# Altium schematic sheet Phase_Measurements.SchDoc
size A4; CompanyName: Technische Hochschule Nürnberg Georg Simon Ohm; Organization: UltraZohm; Address1: Kesslerplatz 12; Address2: 90489 Nürnberg; Address3: GERMANY; SheetNumber: 4; SheetTotal: 9; Website: www.ultrazohm.com
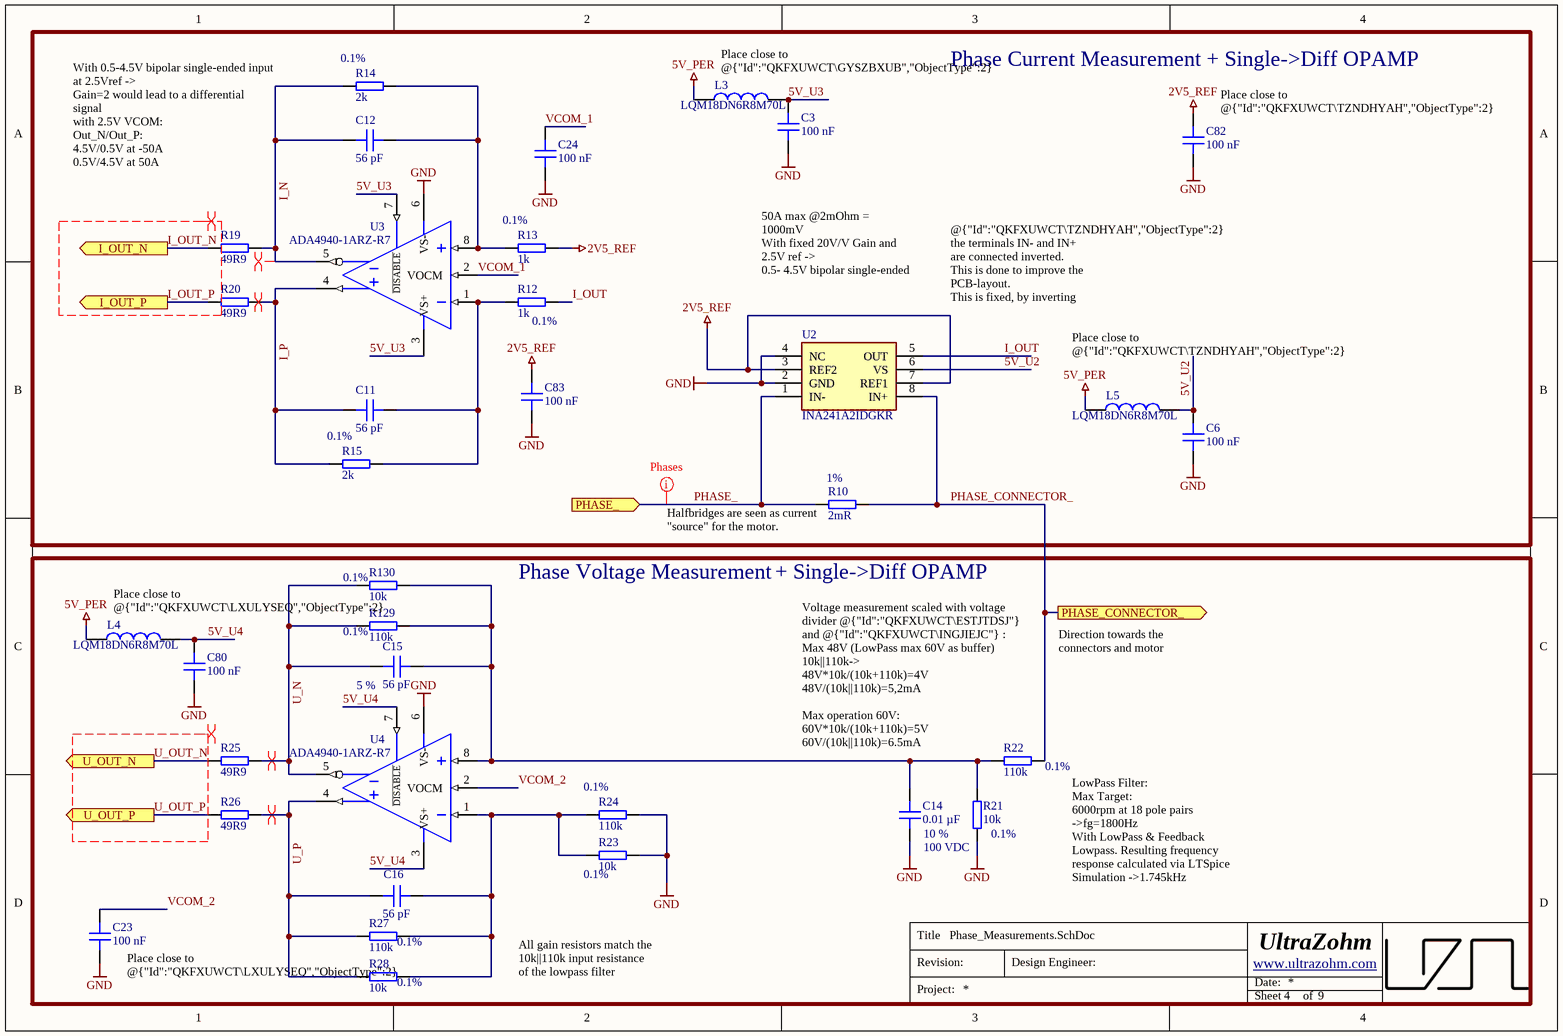
[diagram p0: Phase_Measurements.SchDoc]

## Parts
C3  100 nF  [C_0603]
C6  100 nF  [C_0603]
C11  56 pF  [C_0603]
C12  56 pF  [C_0603]
C14  0.01 µF  Tolerance: 10 %  Voltage Rating: 100 VDC  [C_0805]
C15  56 pF  Tolerance: 5 %  [C_0603]
C16  56 pF  [C_0603]
C23  100 nF  [C_0603]
C24  100 nF  [C_0603]
C80  100 nF  [C_0603]
C82  100 nF  [C_0603]
C83  100 nF  [C_0603]
L3  LQM18DN6R8M70L  [INDC1608X95N]
L4  LQM18DN6R8M70L  [INDC1608X95N]
L5  LQM18DN6R8M70L  [INDC1608X95N]
R10  2mR  Tolerance: 1%  [3921]
R12  1k  Tolerance: 0.1%  [RES 0603_1608]
R13  1k  Tolerance: 0.1%  [RES 0603_1608]
R14  2k  Tolerance: 0.1%  [RES 0603_1608]
R15  2k  Tolerance: 0.1%  [RES 0603_1608]
R19  49R9  [RES 0603_1608]
R20  49R9  [RES 0603_1608]
R21  10k  Tolerance: 0.1%  [RES 0603_1608]
R22  110k  Tolerance: 0.1%  [RES 0603_1608]
R23  10k  Tolerance: 0.1%  [RES 0603_1608]
R24  110k  Tolerance: 0.1%  [RES 0603_1608]
R25  49R9  [RES 0603_1608]
R26  49R9  [RES 0603_1608]
R27  110k  Tolerance: 0.1%  [RES 0603_1608]
R28  10k  Tolerance: 0.1%  [RES 0603_1608]
R129  110k  Tolerance: 0.1%  [RES 0603_1608]
R130  10k  Tolerance: 0.1%  [RES 0603_1608]
U2  INA241A2IDGKR  [SOP65P490X110-8N]
U3  ADA4940-1ARZ-R7  [SOT127P600X175-8N]
U4  ADA4940-1ARZ-R7  [SOT127P600X175-8N]

## Blocks framed on the sheet
Phase Current Measurement + Single->Diff OPAMP: C3 C6 C11 C12 C24 C82 C83 L3 L5 R10 R12-R15 R19 R20 U2 U3

## Ports
I_OUT_N (out), I_OUT_P (out), PHASE_ (in), PHASE_CONNECTOR_ (out), U_OUT_N (out), U_OUT_P (out)

## Nets
2V5_REF: C82.2 C83.2 R13.2 U2.3(REF2) U2.7(REF1)
5V_PER: L3.1 L4.1 L5.1
GND: C3.1 C6.1 C14.1 C23.1 C24.1 C80.1 C82.1 C83.1 R21.1 R23.1 R24.2 U2.2(GND) U2.4(NC) U3.6(VS-) U4.6(VS-)
5V_U2: C6.2 L5.2 U2.6(VS)
5V_U3: C3.2 L3.2 U3.3(VS+) U3.7(~{DISABLE})
5V_U4: C80.2 L4.2 U4.3(VS+) U4.7(~{DISABLE})
I_N: C12.1 R14.1 R19.2 U3.5(VOUT-)
I_OUT: R12.2 U2.5(OUT)
I_OUT_N: R19.1 ; port I_OUT_N
I_OUT_P: R20.1 ; port I_OUT_P
I_P: C11.1 R15.1 R20.2 U3.4(VOUT+)
PHASE_: R10.1 U2.1(IN-) ; port PHASE_
PHASE_CONNECTOR_: R10.2 R22.2 U2.8(IN+) ; port PHASE_CONNECTOR_
U_N: C15.1 R25.2 R129.1 R130.2 U4.5(VOUT-)
U_OUT_N: R25.1 ; port U_OUT_N
U_OUT_P: R26.1 ; port U_OUT_P
U_P: C16.1 R26.2 R27.1 R28.2 U4.4(VOUT+)
VCOM_1: C24.2 U3.2(VOCM)
VCOM_2: C23.2 U4.2(VOCM)
NetC11_2: C11.2 R12.1 R15.2 U3.1(VIN-)
NetC12_2: C12.2 R13.1 R14.2 U3.8(VIN+)
NetC14_2: C14.2 C15.2 R21.2 R22.1 R129.2 R130.1 U4.8(VIN+)
NetC16_2: C16.2 R23.2 R24.1 R27.2 R28.1 U4.1(VIN-)

## Layout directives
differential pair: I_N, I_OUT_N, I_OUT_P, I_P, U_N, U_OUT_N, U_OUT_P, U_P
net class Power: PHASE_

## Notes on the sheet
- Place close to @{"Id":"QKFXUWCT\GYSZBXUB","ObjectType":2} OPAMP
- (near C82) Place close to @{"Id":"QKFXUWCT\TZNDHYAH","ObjectType":2} REF inputs
- With 0.5-4.5V bipolar single-ended input at 2.5Vref ->
  Gain=2 would lead to a differential signal
  with 2.5V VCOM:
  Out_N/Out_P:
  4.5V/0.5V at -50A
  0.5V/4.5V at 50A
- 50A max @2mOhm = 1000mV
  With fixed 20V/V Gain and 2.5V ref ->
  0.5- 4.5V bipolar single-ended
- @{"Id":"QKFXUWCT\TZNDHYAH","ObjectType":2} the terminals IN- and IN+ are connected inverted. This is done to improve the PCB-layout.
  This is fixed, by inverting the inputs at @{"Id":"QKFXUWCT\GYSZBXUB","ObjectType":2} again.
- Place close to @{"Id":"QKFXUWCT\TZNDHYAH","ObjectType":2} OPAMP
- Phase Voltage Measurement
- (near R10) Halfbridges are seen as current "source" for the motor.
- + Single->Diff OPAMP
- Place close to @{"Id":"QKFXUWCT\LXULYSEQ","ObjectType":2} OPAMP
- Direction towards the connectors and motor
- (near R22) Voltage measurement scaled with voltage divider @{"Id":"QKFXUWCT\ESTJTDSJ"} and @{"Id":"QKFXUWCT\INGJIEJC"} :
  Max 48V (LowPass max 60V as buffer)
  10k||110k->
  48V*10k/(10k+110k)=4V
  48V/(10k||110k)=5,2mA
  Max operation 60V:
  60V*10k/(10k+110k)=5V
  60V/(10k||110k)=6.5mA
- (near R22) LowPass Filter:
  Max Target:
  6000rpm at 18 pole pairs
  ->fg=1800Hz
  With LowPass & Feedback Lowpass. Resulting frequency response calculated via LTSpice Simulation ->1.745kHz
- (near C23) Place close to @{"Id":"QKFXUWCT\LXULYSEQ","ObjectType":2} OPAMP
- All gain resistors match the 10k||110k input resistance of the lowpass filter
- Title
- Revision:
- Design Engineer:
- Date:
- Project:
- Sheet
- of

## Library data of the parts
C3 C6 C23 C24 C80 C82 C83 = C1608X7S2A104KT000N: 100V 100nF X7S ±10% 0603 Multilayer Ceramic Capacitors MLCC - SMD/SMT ROHS; Manufacturer: TDK; Voltage Rating: 100 VDC; Created from: AGeiger; Manufacturer Part Number: C1608X7S2A104KT000N; PartID: 148; Created On: 20.12.2020 13:54:13; ComponentLink1Description: Datasheet; ComponentLink1URL: https://datasheet.lcsc.com/lcsc/2304140030_TDK-C1608X7S2A104KT000N_C343025.pdf; Component Type: Capacitor 0603; Device Package: 0603; Last Updated: 14.12.2022 12:14:21; Mounting Type: SMD; Operating Temperature: -55 to 125°C; Series: X7R; Supplier 1: LCSC; Supplier Part Number 1: C343025; Type: Capacitor; Tolerance: 10 %; Value: 100 nF; Live Cycle Status: 1; Stock number: not stored; LCSC Part Number: C343025
C11 C12 C16 = CL10C560JB8NNNC: Capacitor 0603, 50 VDC, 56 pF, C0G; Manufacturer: Samsung Electro-Mechanics; Tolerance: 5 %; Voltage Rating: 50 VDC; Created from: DHufnagel; Manufacturer Part Number: CL10C560JB8NNNC; PartID: 92; Created On: 20.12.2020 13:54:13; ComponentLink1Description: Datasheet; ComponentLink1URL: https://www.mouser.de/datasheet/2/585/MLCC-1837944.pdf; Component Type: Capacitor 0603; Device Package: 0603; Last Updated: 20.12.2020 16:24:16; Mounting Type: SMD; Operating Temperature: -55 - 125°C; Series: CL; Supplier 1: Mouser; Supplier Part Number 1: 187-CL10C560JB8NNNC; Supplier 2: LCSC; Supplier Part Number 2: C39148; Type: Capacitor; Value: 56 pF; Live Cycle Status: 1; LCSC Part Number: C39148; Stock number: not stored
C14 = HV0805X7R103K101NT: 100V 10nF 0805 Multilayer Ceramic Capacitors MLCC - SMD/SMT ROHS; Manufacturer: AIDE; Created from: KIlhan; Manufacturer Part Number: HV0805X7R103K101NT; PartID: 128; Created On: 05.07.2023 15:42:28; ComponentLink1Description: Datasheet; ComponentLink1URL: https://datasheet.lcsc.com/lcsc/2103311437_AIDE-HV1210X7R332K202NT_C2691813.pdf; Component Type: Capacitor 0805; Device Package: 0805; Last Updated: 05.07.2023 15:42:28; Mounting Type: SMD; Operating Temperature: -55 - 125°C; Series: C; Supplier 1: JLCPCB; Supplier Part Number 1: HV0805X7R103K101NT; Type: Capacitor; Value: 0.01 µF; Live Cycle Status: 1; Stock number: not stored; LCSC Part Number: C2691724
C15 = CL10C560JB8NNNC: Capacitor 0603, 50 VDC, 56 pF, C0G; Manufacturer: Samsung Electro-Mechanics; Voltage Rating: 50 VDC; Created from: DHufnagel; Manufacturer Part Number: CL10C560JB8NNNC; PartID: 92; Created On: 20.12.2020 13:54:13; ComponentLink1Description: Datasheet; ComponentLink1URL: https://www.mouser.de/datasheet/2/585/MLCC-1837944.pdf; Component Type: Capacitor 0603; Device Package: 0603; Last Updated: 20.12.2020 16:24:16; Mounting Type: SMD; Operating Temperature: -55 - 125°C; Series: CL; Supplier 1: Mouser; Supplier Part Number 1: 187-CL10C560JB8NNNC; Type: Capacitor; Value: 56 pF; Live Cycle Status: 1; Stock number: not stored; Supplier 2: LCSC; Supplier Part Number 2: C39148; LCSC Part Number: C39148
L3-L5 = LQM18DN6R8M70L: 6.8µH, 120mA, 0603, 740mOhm, 20%; Manufacturer: Murata; MF: EPCOS / TDK; Value: 6.8uH; DCR: 320m; Rated Current: 0.85 A; Type: fixed inductor; Created from: DHufnagel; MPN: B82464G4154M; Supplier 1: Mouser; Supplier Part Number 1: 81-LQM18DN6R8M70L; Manufacturer Part Number: LQM18DN6R8M70L; PartID: 10; Created On: 19.07.2022 15:47:17; ComponentLink1Description: Datasheet; ComponentLink1URL: https://www.mouser.de/datasheet/2/281/1/JELF243B_0086-2298241.pdf; Component Type: SMD fixed inductor; Device Package: SMD; Last Updated: 15.06.2023 16:03:16; Mounting Type: SMD; Operating Temperature: -40 - 125°C; Series: LQM18DN_70; Supplier 2: Digi-Key; Supplier Part Number 2: 490-LQM18DN6R8M70LCT-ND; DC current: 120mA; Live Cycle Status: 1; Stock number: not stored; LCSC Part Number: C1881372
R10 = WSL39212L000FEA: Current Sense Resistors - SMD 3watts .002ohms 1%; Manufacturer: Vishay; Created from: AGeiger; Manufacturer Part Number: WSL39212L000FEA; PartID: 327; Created On: 05.03.2024 08:52:09; ComponentLink1Description: Datasheet; ComponentLink1URL: https://www.vishay.com/docs/30110/wsl3921-wsl5931.pdf; Component Type: Shunt SMD resistor; Device Package: 3921; Last Updated: 05.03.2024 08:53:02; Mounting Type: SMD; Supplier 1: Mouser; Supplier Part Number 1: 71-WSL39212L000FEA; Type: Shunt; Value: 2mR; Live Cycle Status: 1; LCSC Part Number: C844494; Supplier 2: LCSC; Supplier Part Number 2: C844494
R12 R13 = PCF-W0603LF-03-1001-B-P-LT: SMD resistor 0.1%; Manufacturer: IRC / TT Electronics; Created from: MGremer; Manufacturer Part Number: PCF-W0603LF-03-1001-B-P-LT; PartID: 163; Created On: 14.12.2020 16:17:14; ComponentLink1Description: Datasheet; ComponentLink1URL: https://www.mouser.de/datasheet/2/414/PCF-1528243.pdf; Component Type: SMD resistor; Device Package: 0603; Last Updated: 21.02.2024 15:45:55; Mounting Type: SMD; Supplier 1: Mouser; Supplier Part Number 1: 66-PCFW0603LF031001B; Type: Resistor; Value: 1k; Live Cycle Status: 1; Stock number: not stored; LCSC Part Number: C110776
R14 R15 = ERJ-PB3B2001V: SMD resistor 0.1%; Manufacturer: Panasonic; Created from: DHufnagel; Manufacturer Part Number: ERJ-PB3B2001V; PartID: 215; Created On: 14.12.2020 16:17:14; ComponentLink1Description: Datasheet; ComponentLink1URL: https://www.mouser.de/datasheet/2/315/AOA0000C328-1530132.pdf; Component Type: SMD resistor; Device Package: 0603; Last Updated: 02.03.2021 14:07:32; Mounting Type: SMD; Supplier 1: Mouser; Supplier Part Number 1: 667-ERJ-PB3B2001V; Supplier 2: LCSC; Supplier Part Number 2: C189729; Type: Resistor; Value: 2k; Live Cycle Status: 1; Stock number: not stored; LCSC Part Number: C189729
R19 R20 R25 R26 = RK73H1JTTD49R9F: SMD resistor 1%; Manufacturer: KOA Speer; Created from: DHufnagel; Manufacturer Part Number: RK73H1JTTD49R9F; PartID: 214; Created On: 14.12.2020 16:17:14; ComponentLink1Description: Datasheet; ComponentLink1URL: https://www.mouser.de/datasheet/2/219/RK73H-1825326.pdf; Component Type: SMD resistor; Device Package: 0603; Last Updated: 27.05.2022 13:46:35; Mounting Type: SMD; Supplier 1: Mouser; Supplier Part Number 1: 660-RK73H1JTTD49R9F; Supplier 2: LCSC; Supplier Part Number 2: C160046; Type: Resistor; Tolerance: 1%; Value: 49R9; Live Cycle Status: 1; Stock number: not stored; LCSC Part Number: C160046
R21 R23 R28 R130 = RQ73C1J10KBTD: SMD resistor 0.1%, 10ppm; Manufacturer: TE Connectivity; Created from: DHufnagel; Manufacturer Part Number: RQ73C1J10KBTD; PartID: 231; Created On: 14.12.2020 16:17:14; ComponentLink1Description: Datasheet; ComponentLink1URL: https://www.mouser.de/datasheet/2/418/5/ENG_DS_1773270_2_B-1533717.pdf; Component Type: SMD resistor; Device Package: 0603; Last Updated: 21.02.2024 15:51:17; Mounting Type: SMD; Supplier 1: Mouser; Supplier Part Number 1: 279-RQ73C1J10KBTD; Type: Resistor; Value: 10k; Live Cycle Status: 1; Stock number: not stored; Supplier 2: LCSC; Supplier Part Number 2: C95204; LCSC Part Number: C95204
R22 R24 R27 R129 = RQ73C1J110KBTD: SMD resistor 0.1%, 10ppm; Manufacturer: TE Connectivity / Holsworthy; Created from: DHufnagel; Manufacturer Part Number: RQ73C1J110KBTD; PartID: 216; Created On: 14.12.2020 16:17:14; ComponentLink1Description: Datasheet; ComponentLink1URL: https://www.mouser.de/datasheet/2/418/5/ENG_DS_1773270_2_B-1533717.pdf; Component Type: SMD resistor; Device Package: 0603; Last Updated: 21.02.2024 16:00:52; Mounting Type: SMD; Supplier 1: Mouser; Supplier Part Number 1: 279-RQ73C1J110KBTD; Type: Resistor; Value: 110k; Live Cycle Status: 1; Stock number: not stored; Supplier 2: LCSC; Supplier Part Number 2: C326736; LCSC Part Number: C326736
U2 = INA241A2IDGKR: Current Sense Amplifier, 5-100 V  CMV, 20 V/V, bidirectional; Manufacturer: Texas Instruments; Channels: 1; GBP: 100MHz; CMRR: 89dB; Value: Rail-to-Rail; Created from: KPatel; Manufacturer Part Number: INA241A2IDGKR; PartID: 30; Created On: 6/28/2024 9:00:46 AM; ComponentLink1Description: Datasheet; ComponentLink1URL: https://www.ti.com/lit/ds/symlink/ina241b.pdf?ts=1718088817119&ref_url=https%253A%252F%252Fwww.mouser.de%252F; Component Type: Current Sense Amplifier; Device Package: VSSOP-8; Last Updated: 6/28/2024 9:00:46 AM; Mounting Type: SMD; Operating Temperature: -40 - 125°C; Series: INA241A; Supplier 1: Mouser; Supplier Part Number 1: 595-INA241A2IDGKR; Type: Current Sense Amplifier; Live Cycle Status: 1; Stock number: not stored
U3 U4 = ADA4940-1ARZ-R7: Fully Differential Amplifier, Ultralow-Power,Low Distortion, 260-MHz; Manufacturer: Analog Devices; Channels: 1; GBP: 260 MHz; CMRR: 86 dB; Created from: DHufnagel; Manufacturer Part Number: ADA4940-1ARZ-R7; PartID: 14; Created On: 18.08.2022 12:53:27; ComponentLink1Description: Datasheet; ComponentLink1URL: https://www.mouser.de/datasheet/2/609/ada4940_1_4940_2-2955874.pdf; Component Type: Differential Amplifier; Device Package: SOIC-8; Last Updated: 18.08.2022 13:04:18; Mounting Type: SMD; Operating Temperature: -40 - 105°C; Series: ADA4940-1; Supplier 1: Mouser; Supplier Part Number 1: 584-ADA4940-1ARZ; Supplier 2: Digi-Key; Supplier Part Number 2: 505-ADA4940-1ARZ-ND; Supplier 3: LCSC; Supplier Part Number 3: C730049; Type: Differential Amplifiers; Live Cycle Status: 1; LCSC Part Number: C730049; Stock number: not stored